# Altium schematic sheet relay_drivers.SchDoc
size B
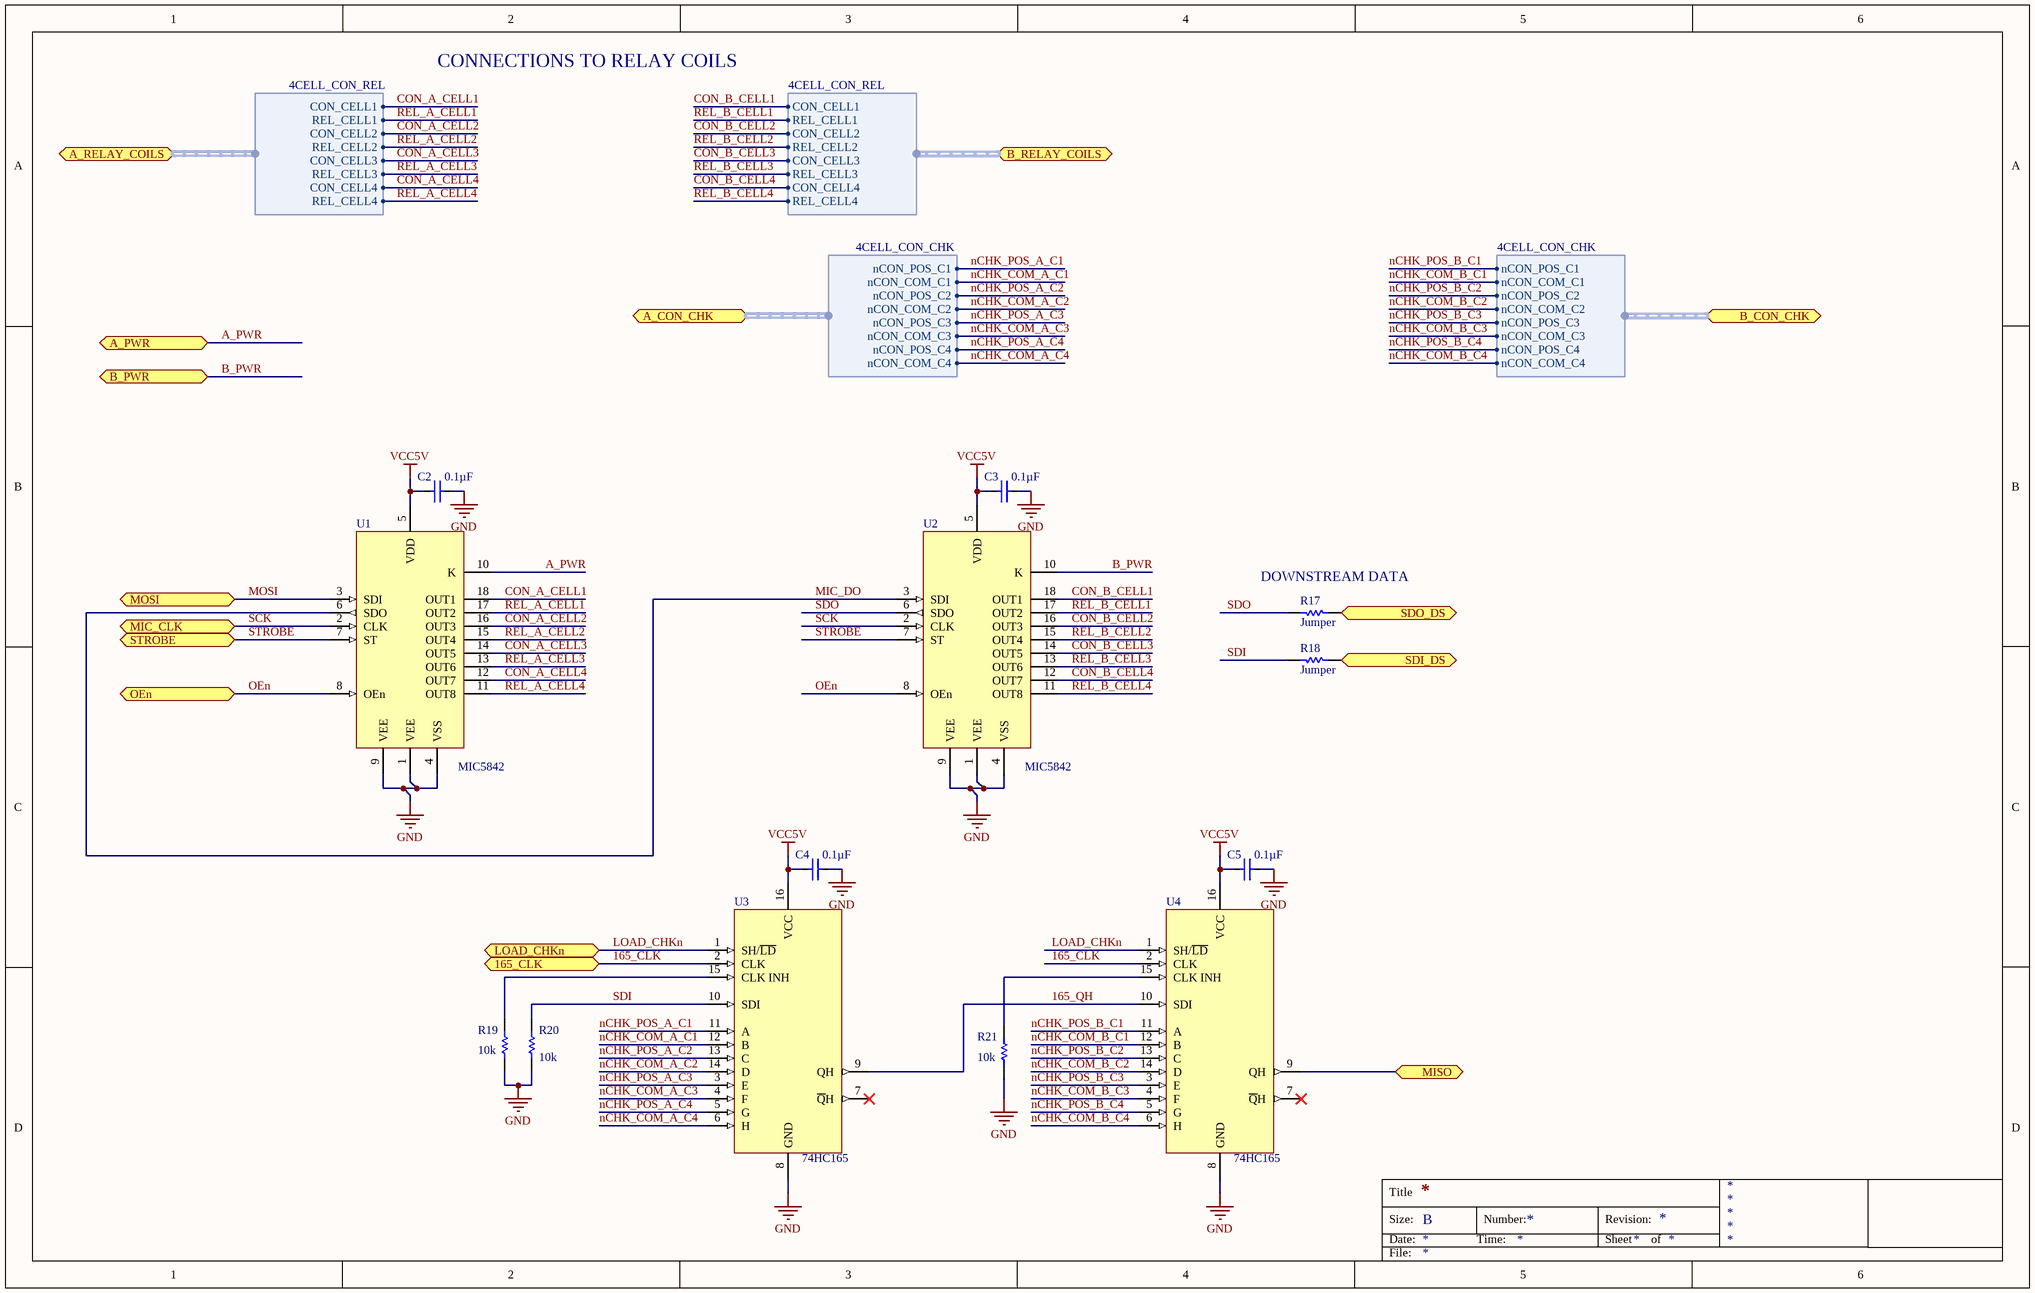
[diagram p0: relay_drivers.SchDoc]

## Parts
C2  0.1µF  [CAPC1005X55L25N]
C3  0.1µF  [CAPC1005X55L25N]
C4  0.1µF  [CAPC1005X55L25N]
C5  0.1µF  [CAPC1005X55L25N]
R17  Jumper  [RESC_2012[0805]_N]
R18  Jumper  [RESC_2012[0805]_N]
R19  10k  [RESC2012X75L55N]
R20  10k  [RESC2012X75L55N]
R21  10k  [RESC2012X75L55N]
U1  MIC5842  [SOIC18P127_1155X1030X265L83X41N]
U2  MIC5842  [SOIC18P127_1155X1030X265L83X41N]
U3  74HC165  [SOIC16P127_990X600X175L83X41N]
U4  74HC165  [SOIC16P127_990X600X175L83X41N]

## Ports
165_CLK, A_CON_CHK (harness 4CELL_CON_CHK), A_PWR, A_RELAY_COILS (harness 4CELL_CON_REL), B_CON_CHK (harness 4CELL_CON_CHK), B_PWR, B_RELAY_COILS (harness 4CELL_CON_REL), LOAD_CHKn, MIC_CLK, MISO, MOSI, OEn, SDI_DS, SDO_DS, STROBE

## Harnesses
4CELL_CON_REL: CON_CELL1, REL_CELL1, CON_CELL2, REL_CELL2, CON_CELL3, REL_CELL3, CON_CELL4, REL_CELL4
4CELL_CON_CHK: nCON_COM_C1, nCON_POS_C1, nCON_POS_C2, nCON_COM_C2, nCON_POS_C3, nCON_COM_C3, nCON_POS_C4, nCON_COM_C4

## Nets
GND: C2.2 C3.2 C4.2 C5.2 R19.1 R20.1 R21.1 U1.1(VEE) U1.4(VSS) U1.9(VEE) U2.1(VEE) U2.4(VSS) U2.9(VEE) U3.8(GND) U4.8(GND)
VCC5V: C2.1 C3.1 C4.1 C5.1 U1.5(VDD) U2.5(VDD) U3.16(VCC) U4.16(VCC)
165_CLK: U3.2(CLK) U4.2(CLK) ; port 165_CLK
165_QH: U3.9(QH) U4.10(SDI)
A_PWR: U1.10(K) ; port A_PWR
B_PWR: U2.10(K) ; port B_PWR
CON_A_CELL1: U1.18(OUT1) ; port A_RELAY_COILS.CON_CELL1
CON_A_CELL2: U1.16(OUT3) ; port A_RELAY_COILS.CON_CELL2
CON_A_CELL3: U1.14(OUT5) ; port A_RELAY_COILS.CON_CELL3
CON_A_CELL4: U1.12(OUT7) ; port A_RELAY_COILS.CON_CELL4
CON_B_CELL1: U2.18(OUT1) ; port B_RELAY_COILS.CON_CELL1
CON_B_CELL2: U2.16(OUT3) ; port B_RELAY_COILS.CON_CELL2
CON_B_CELL3: U2.14(OUT5) ; port B_RELAY_COILS.CON_CELL3
CON_B_CELL4: U2.12(OUT7) ; port B_RELAY_COILS.CON_CELL4
LOAD_CHKn: U3.1(SH/~{LD}) U4.1(SH/~{LD}) ; port LOAD_CHKn
MIC_DO: U1.6(SDO) U2.3(SDI)
MISO: U4.9(QH) ; port MISO
MOSI: U1.3(SDI) ; port MOSI
nCHK_COM_A_C1: U3.12(B) ; port A_CON_CHK.nCON_COM_C1
nCHK_COM_A_C2: U3.14(D) ; port A_CON_CHK.nCON_COM_C2
nCHK_COM_A_C3: U3.4(F) ; port A_CON_CHK.nCON_COM_C3
nCHK_COM_A_C4: U3.6(H) ; port A_CON_CHK.nCON_COM_C4
nCHK_COM_B_C1: U4.12(B) ; port B_CON_CHK.nCON_COM_C1
nCHK_COM_B_C2: U4.14(D) ; port B_CON_CHK.nCON_COM_C2
nCHK_COM_B_C3: U4.4(F) ; port B_CON_CHK.nCON_COM_C3
nCHK_COM_B_C4: U4.6(H) ; port B_CON_CHK.nCON_COM_C4
nCHK_POS_A_C1: U3.11(A) ; port A_CON_CHK.nCON_POS_C1
nCHK_POS_A_C2: U3.13(C) ; port A_CON_CHK.nCON_POS_C2
nCHK_POS_A_C3: U3.3(E) ; port A_CON_CHK.nCON_POS_C3
nCHK_POS_A_C4: U3.5(G) ; port A_CON_CHK.nCON_POS_C4
nCHK_POS_B_C1: U4.11(A) ; port B_CON_CHK.nCON_POS_C1
nCHK_POS_B_C2: U4.13(C) ; port B_CON_CHK.nCON_POS_C2
nCHK_POS_B_C3: U4.3(E) ; port B_CON_CHK.nCON_POS_C3
nCHK_POS_B_C4: U4.5(G) ; port B_CON_CHK.nCON_POS_C4
OEn: U1.8(OEn) U2.8(OEn) ; port OEn
REL_A_CELL1: U1.17(OUT2) ; port A_RELAY_COILS.REL_CELL1
REL_A_CELL2: U1.15(OUT4) ; port A_RELAY_COILS.REL_CELL2
REL_A_CELL3: U1.13(OUT6) ; port A_RELAY_COILS.REL_CELL3
REL_A_CELL4: U1.11(OUT8) ; port A_RELAY_COILS.REL_CELL4
REL_B_CELL1: U2.17(OUT2) ; port B_RELAY_COILS.REL_CELL1
REL_B_CELL2: U2.15(OUT4) ; port B_RELAY_COILS.REL_CELL2
REL_B_CELL3: U2.13(OUT6) ; port B_RELAY_COILS.REL_CELL3
REL_B_CELL4: U2.11(OUT8) ; port B_RELAY_COILS.REL_CELL4
SCK: U1.2(CLK) U2.2(CLK) ; port MIC_CLK
SDI: R18.2 R20.2 U3.10(SDI)
SDI_DS: R18.1 ; port SDI_DS
SDO: R17.2 U2.6(SDO)
SDO_DS: R17.1 ; port SDO_DS
STROBE: U1.7(ST) U2.7(ST) ; port STROBE
NetR19_2: R19.2 U3.15(CLK_INH)
NetR21_2: R21.2 U4.15(CLK_INH)

Not connected (* = marked no-connect by the designer): U3 7(~{Q}H)*; U4 7(~{Q}H)*

## Notes on the sheet
- CONNECTIONS TO RELAY COILS
- (near R17) DOWNSTREAM DATA
- Title
- Size:
- Date:
- B
- Time:
- Number:
- Revision:
- Sheet
- of
- File:

## Library data of the parts
C2-C5 = GRM155R71C104JA88D: CAP CER 0.1UF 16V X7R 0402; Manufacturer: Murata Electronics North America; Tolerance: ±5%; Design Item Id: GRM155R71C104JA88D; Supplier 1: Digi-Key; Supplier Part Number 1: 490-6327-1-ND; Manufacturer Part Number: GRM155R71C104JA88D; RoHS: RoHS Compliant; Category: Capacitors; Stock 1: 844721; Pricing 1: 1=0.1, 10=0.026, 50=0.0144, 100=0.0121, 250=0.00992, 500=0.00848, 1000=0.0066, 5000=0.0055 (USD); Packaging: Cut Tape (CT); Applications: General Purpose; Operating Temperature: -55°C ~ 125°C; Mounting Type: Surface Mount, MLCC; Package / Case: 0402 (1005 Metric); ComponentLink1URL: http://www.murata.com/~/media/webrenewal/support/library/catalog/products/capacitor/mlcc/c02e.pdf; ComponentLink1Description: http://www.murata.com/~/media/webrenewal/support/library/catalog/products/capacitor/mlcc/c02e.pdf; Capacitance: 0.1µF; Voltage - Rated: 16V; Temperature Coefficient: X7R; Ratings: -; Size / Dimension: 0.039" L x 0.020" W (1.00mm x 0.50mm); Height - Seated (Max): -; Thickness (Max): 0.022" (0.55mm); Lead Spacing: -; Features: -; Lead Style: *
R17 R18 = WSL0805R0500FEA18: RES SMD 0.05 OHM 1% 1/4W 0805; Manufacturer: Vishay Dale; Resistance: 0.05; Power (Watts): 0.25W, 1/4W; Temperature Coefficient: ±75ppm/°C; Design Item Id: WSL0805R0500FEA18; Supplier 1: Digi-Key; Supplier Part Number 1: WSLB-.05CT-ND; Manufacturer Part Number: WSL0805R0500FEA18; RoHS: RoHS Compliant; Category: Resistors; Stock 1: 6290; Pricing 1: 1=1, 10=0.887, 25=0.8152, 50=0.7436, 100=0.6435, 250=0.5434, 500=0.4576, 1000=0.38038, 2500=0.3718 (USD); Packaging: Cut Tape (CT); Operating Temperature: -65°C ~ 170°C; Package / Case: 0805 (2012 Metric); Supplier Device Package: 0805; ComponentLink1URL: http://www.vishay.com/docs/31057/wslhigh.pdf; ComponentLink1Description: http://www.vishay.com/docs/31057/wslhigh.pdf; Tolerance: ±1%; Composition: Metal Element; Features: Current Sense, Moisture Resistant, Pulse Withstanding; Size / Dimension: 0.080" L x 0.050" W (2.03mm x 1.27mm); Height: 0.018" (0.46mm); Number of Terminations: 2
R19-R21 = ERJ-P06J103V: RES SMD 10K OHM 5% 1/2W 0805; Manufacturer: Panasonic Electronic Components; Power (Watts): 0.5W, 1/2W; Temperature Coefficient: ±200ppm/°C; Resistance: 10k; Design Item Id: ERJ-P06J103V; Supplier 1: Digi-Key; Supplier Part Number 1: P10KADCT-ND; Manufacturer Part Number: ERJ-P06J103V; RoHS: RoHS Compliant; Category: Resistors; Stock 1: 181490; Pricing 1: 1=0.12, 10=0.112, 100=0.0429, 1000=0.01889, 2500=0.01632 (USD); Packaging: Cut Tape (CT); Operating Temperature: -55°C ~ 155°C; Package / Case: 0805 (2012 Metric); Supplier Device Package: 0805; ComponentLink1URL: https://industrial.panasonic.com/cdbs/www-data/pdf/RDO0000/AOA0000C331.pdf; ComponentLink1Description: https://industrial.panasonic.com/cdbs/www-data/pdf/RDO0000/AOA0000C331.pdf; Tolerance: ±5%; Composition: Thick Film; Features: Automotive AEC-Q200, Pulse Withstanding; Size / Dimension: 0.079" L x 0.049" W (2.00mm x 1.25mm); Part Status: Active; Height - Seated (Max): 0.028" (0.70mm); Failure Rate: -
U1 U2 = MIC5842YWM: IC DRVR LATCH 8BIT SER IN 18SOIC; Manufacturer: Microchip Technology; Current - Output (Max): 500mA; Switch Type: Latched Driver; Number of Outputs: 8; Output Configuration: Low Side; Output Type: Bipolar; Interface: Strobe, Serial; Voltage - Load: 15V (Max); Input Type: Non-Inverting; Design Item Id: MIC5842YWM; Supplier 1: Digi-Key; Supplier Part Number 1: 576-2402-ND; Manufacturer Part Number: MIC5842YWM; RoHS: RoHS Compliant; Category: Integrated Circuits (ICs); Stock 1: 306; Pricing 1: 1=2.91, 25=2.4256, 100=2.205 (USD); Packaging: Tube; Features: -; Operating Temperature: -55°C ~ 85°C (TA); Package / Case: 18-SOIC (0.295", 7.50mm Width); Supplier Device Package: 18-SOP (Wide); ComponentLink1URL: http://www.microchip.com/mymicrochip/filehandler.aspx?ddocname=en580483; ComponentLink1Description: http://www.microchip.com/mymicrochip/filehandler.aspx?ddocname=en580483; Part Status: Active; Voltage - Supply (Vcc/Vdd): -; Rds On (Typ): -; Fault Protection: -
U3 U4 = 74HC165D: IC 8BIT SHIFT REGISTER 16SOIC; Manufacturer: Toshiba Semiconductor and Storage; Function: Parallel or Serial to Serial; Output Type: Complementary; Voltage - Supply: 2 V ~ 6 V; Design Item Id: 74HC165D; Supplier 1: Digi-Key; Supplier Part Number 1: 74HC165DCT-ND; Manufacturer Part Number: 74HC165D; RoHS: RoHS Compliant; Category: Integrated Circuits (ICs); Stock 1: 4480; Pricing 1: 1=0.41, 10=0.32, 25=0.27, 100=0.2199, 250=0.1822, 500=0.1508, 1000=0.11309 (USD); Packaging: Cut Tape (CT); Operating Temperature: -40°C ~ 85°C; Mounting Type: Surface Mount; Package / Case: 16-SOIC (0.154", 3.90mm Width); Supplier Device Package: 16-SOIC; ComponentLink1URL: https://toshiba.semicon-storage.com/info/docget.jsp?did=37227&prodName=74HC165D; ComponentLink1Description: https://toshiba.semicon-storage.com/info/docget.jsp?did=37227&prodName=74HC165D; Logic Type: Shift Register; Part Status: Active